# EAGLE design ext_esp_wroom_32-3 (EAGLE 9.6.2)
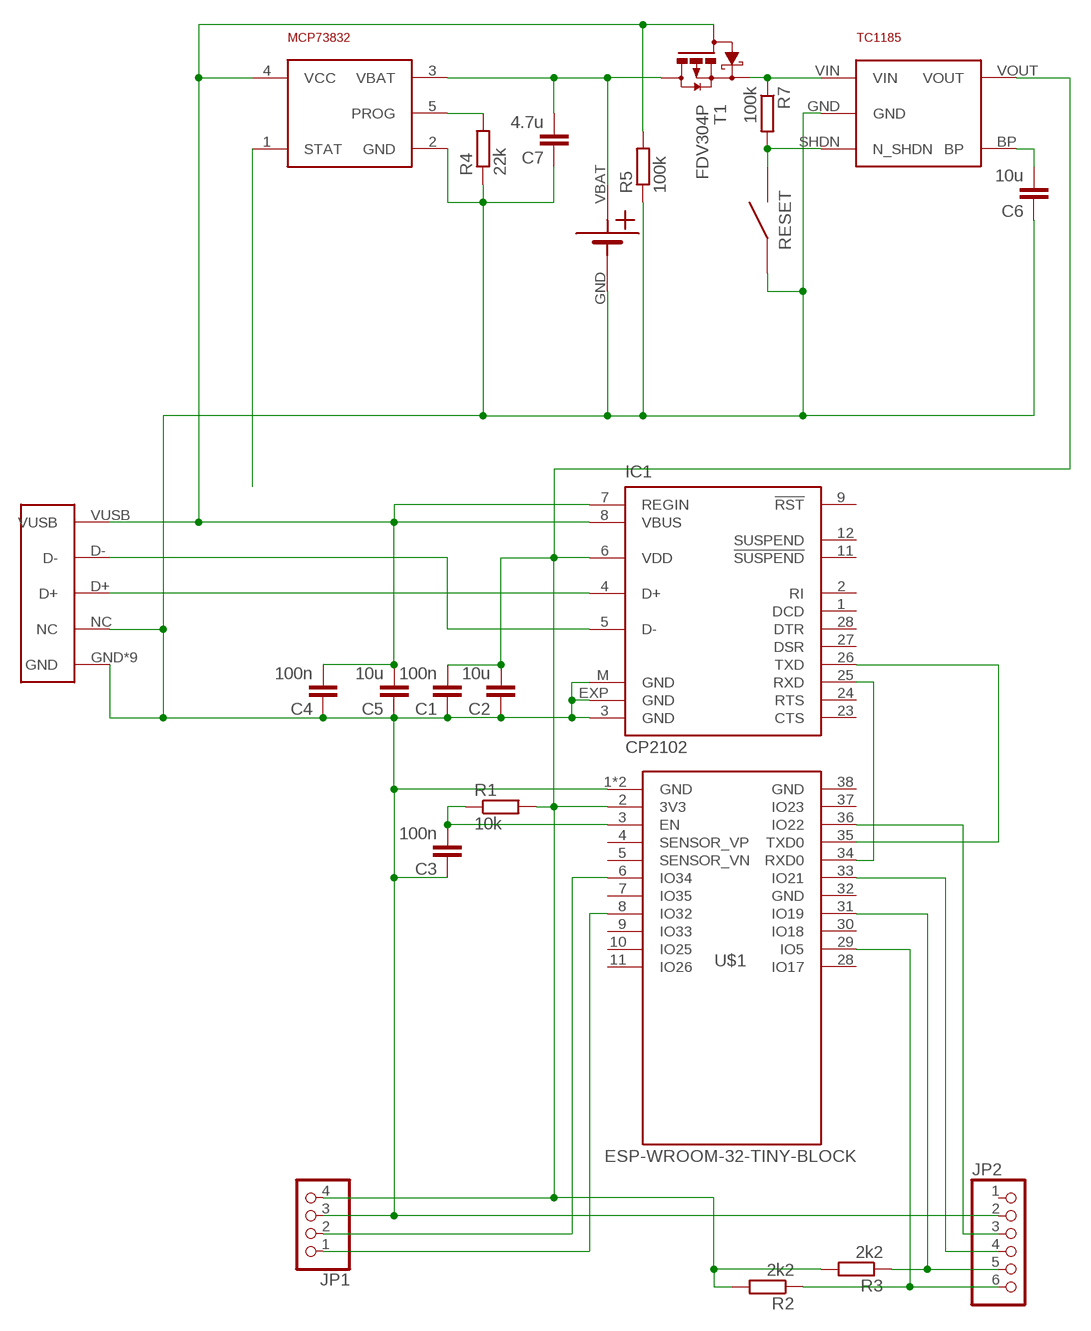
[diagram p0: schematic, sheet 1]

## Parts
C1  100n  C-EUC0805K  [C0805K]
C2  10u  C-EUC0805K  [C0805K]
C3  100n  C-EUC0805K  [C0805K]
C4  100n  C-EUC0805K  [C0805K]
C5  10u  C-EUC0805K  [C0805K]
C6  10u  C-EUC0805K  [C0805K]
C7  4.7u  C-EUC0603K  [C0603K]
IC1  CP2102  [MLP28]
JP1  PINHD-1X4  [1X04]
JP2  PINHD-1X6  [1X06]
MCP73832  MCP73831  [SOT23-5]
R1  10k  R-EU_R0805  [R0805]
R2  2k2  R-EU_R0805  [R0805]
R3  2k2  R-EU_R0805  [R0805]
R4  22k  R-EU_R0603  [R0603]
R5  100k  R-EU_R0603  [R0603]
R7  100k  R-EU_R0603  [R0603]
RESET  BYTTON-B3U  [BUTTON-B3U]
T1  FDV304P  P-MOSFET-FDV304P  [SOT23]
TC1185  TC1185  STABILISER_APE8865  [SOT32-5]
U$1  ESP-WROOM-32-TINY-BLOCK  [ESP-WROOM-32-TINY-BLOCK]
U$3  LIPOL_21X17  [LIPOL_21X17]
USB  USBMICRO  [MICROUSB-MOLEX]

## Nets
EN: C3.2 R1.1 U$1.3(EN)
GND: C1.1 C2.1 C3.1 C4.1 C5.1 C6.1 C7.1 IC1.3(GND) IC1.EXP(GND) IC1.M(GND) JP1.3 JP2.2 MCP73832.2(GND) R4.1 R5.1 RESET.P$1 TC1185.GND U$1.1(GND) U$1.GND U$3.GND USB.GND USB.GND1(GND) USB.GND2(GND) USB.GND3(GND) USB.GND4(GND) USB.NC USB.P$1(GND) USB.P$2(GND) USB.P$3(GND) USB.P$6(GND)
N$1: IC1.5(D-) USB.D-
N$2: IC1.4(D+) USB.D+
N$3: C6.2 TC1185.BP
N$4: IC1.26(TXD) U$1.35(TXD0)
N$6: IC1.25(RXD) U$1.34(RXD0)
N$7: R7.1 T1.S TC1185.VIN
N$8: C7.2 MCP73832.3(VBAT) T1.D U$3.VBAT
N$9: C4.2 C5.2 IC1.7(REGIN) IC1.8(VBUS) MCP73832.4(VCC) R5.2 T1.G USB.VUSB
N$11: MCP73832.5(PROG) R4.2
N$13: MCP73832.1(STAT)
N$20: R7.2 RESET.P$2 TC1185.SHDN(N_SHDN)
P0: JP1.2 U$1.6(IO34)
P1: JP1.1 U$1.8(IO32)
P4: JP2.3 U$1.36(IO22)
SCL: JP2.5 R3.1 U$1.31(IO19)
SDA: JP2.6 R2.1 U$1.29(IO5)
UPDI: JP2.4 U$1.33(IO21)
VCC: C1.2 C2.2 IC1.6(VDD) JP1.4 R1.2 R2.2 R3.2 TC1185.VOUT U$1.2(3V3)
Unconnected: IC1.1(DCD) IC1.2(RI) IC1.9(!RST) IC1.11(!SUSPEND) IC1.12(SUSPEND) IC1.23(CTS) IC1.24(RTS) IC1.27(DSR) IC1.28(DTR) JP2.1 U$1.4(SENSOR_VP) U$1.5(SENSOR_VN) U$1.7(IO35) U$1.9(IO33) U$1.10(IO25) U$1.11(IO26) U$1.28(IO17) U$1.30(IO18) U$1.37(IO23)

## Power pins joined to a net without a drawn wire
GND: U$1.32(GND) U$1.38(GND)

## Library data of the parts
C1-C6 = rcl:C-EU: CAPACITOR, European symbol; SPICEPREFIX: C
C7 = resistor:C-EU: CAPACITOR, European symbol
IC1 = silabs:CP210*: Single-Chip USB to UART Bridge Source: www.silabs.com .. CP2101.pdf / cp2102.pdf; MF: FARNELL; MPN: CP2102-GM; OC_FARNELL: 9282130; OC_NEWARK: 30K5635
JP1 = pinhead2:PINHD-1X4: PIN HEADER
JP2 = pinhead2:PINHD-1X6: PIN HEADER
MCP73832 = !stavebnice03:MCP73831
R1-R3 = rcl:R-EU_: RESISTOR, European symbol; SPICEPREFIX: R
R4 R5 R7 = resistor:R-EU_: RESISTOR, European symbol
RESET = !stavebnice03:BYTTON-B3U
T1 = !stavebnice03:P-MOSFET-FDV304P
TC1185 = !stavebnice03:STABILISER_APE8865
U$1 = esp32:ESP-WROOM-32-TINY-BLOCK
U$3 = !stavebnice03:LIPOL_21X17
USB = !stavebnice03:USBMICRO

## Board
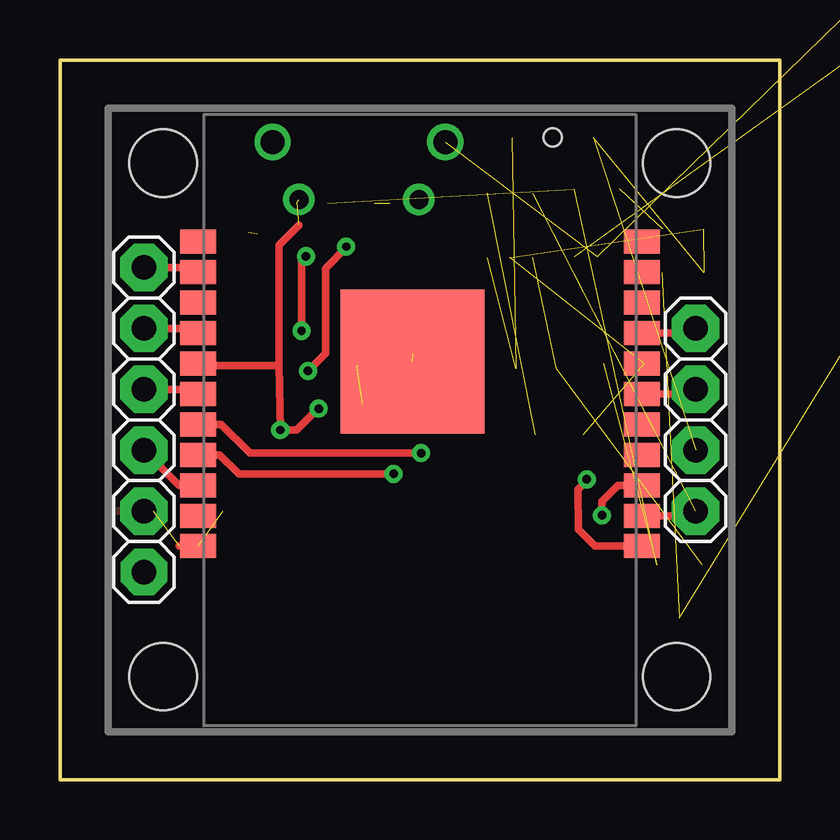
[diagram p1: board, top side]
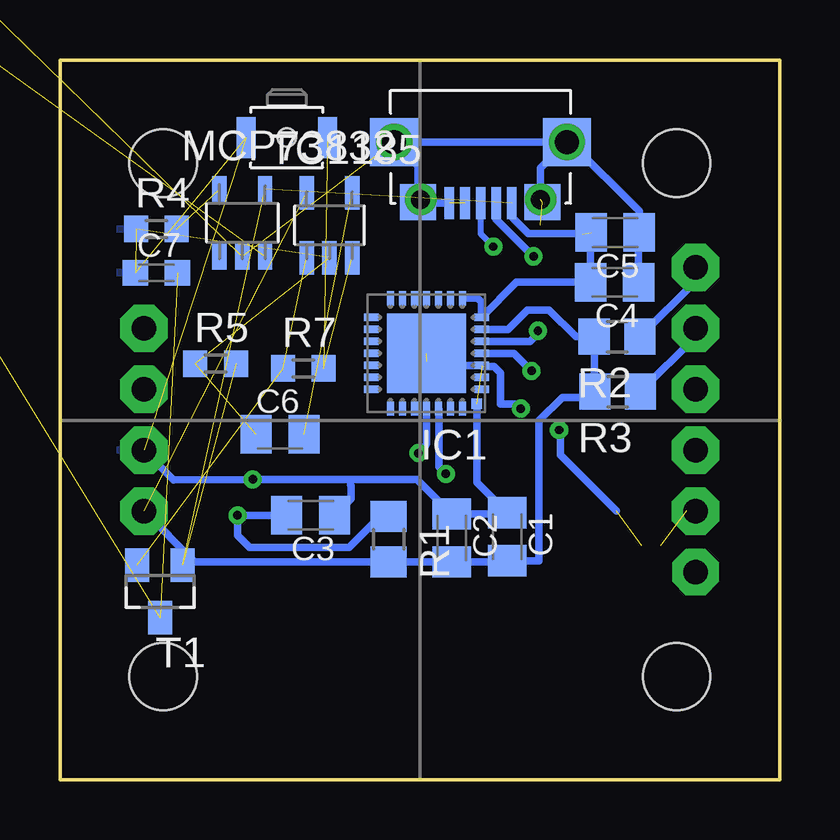
[diagram p2: board, bottom side, seen from below]

Size 30 x 30 mm. Coordinates in mm from the lower left corner, seen from the top.
Outline: 0,0 0,30 30,30 30,0 0,0
Copper layers (1*16): Top 0.035mm / dielectric 1.5mm / Bottom 0.035mm
Design rules "default *": minimum track width 10mil, minimum drill 0.35mm, track to track 6mil, track to pad 6mil, pad to pad 6mil, via to via 6mil, smd to smd 6mil, copper to edge 15mil, drill to drill 15mil, minimum pad ring 10mil, minimum via ring 8mil, stop-mask expansion 4mil, vias tented up to drill 0mil, thermal gap 10mil
Holes 2.8 mm at 4.3,4.3 25.7,25.7 25.7,4.3 4.3,25.7

### Footprints (pad centres in the part's own frame; a part is rotated, then mirrored left to right if it is on the bottom)
C0805K = smd 1.3 x 1.6: 1 -1,0; 2 1,0
C0603K = smd 1.05 x 1.08: 1 -0.875,0; 2 0.875,0
MLP28 = smd 0.6 x 0.3: 1 -2.3,1.5; 2 -2.3,1; 3 -2.3,0.5; 4 -2.3,0; 5 -2.3,-0.5; 6 -2.3,-1; 7 -2.3,-1.5; 15 2.3,-1.5; 16 2.3,-1; 17 2.3,-0.5; 18 2.3,0; 19 2.3,0.5; 20 2.3,1; 21 2.3,1.5 | smd 0.3 x 0.6: 8 -1.5,-2.3; 9 -1,-2.3; 10 -0.5,-2.3; 11 0,-2.3; 12 0.5,-2.3; 13 1,-2.3; 14 1.5,-2.3; 22 1.5,2.3; 23 1,2.3; 24 0.5,2.3; 25 0,2.3; 26 -0.5,2.3; 27 -1,2.3; 28 -1.5,2.3 | smd 3.3 x 3.3: EXP 0,0 | smd 0.435 x 0.435: M -2.103,2.103
1X04 = drill 1.016 pad 1.981 octagon: 1 -3.81,0; 2 -1.27,0; 3 1.27,0; 4 3.81,0
1X06 = drill 1.016 pad 1.93 octagon: 1 -6.35,0 | drill 1.016 pad 1.981 octagon: 2 -3.81,0; 3 -1.27,0; 4 1.27,0; 5 3.81,0; 6 6.35,0
SOT23-5 = smd 0.6 x 1.1: 1 -0.95,-1.45; 2 0,-1.45; 3 0.95,-1.45; 4 0.95,1.35; 5 -0.95,1.35
R0805 = smd 1.3 x 1.5: 1 -0.95,0; 2 0.95,0
R0603 = smd 1 x 1.1: 1 -0.85,0; 2 0.85,0
BUTTON-B3U = smd 0.8 x 1.7: P$1 -1.7,0; P$2 1.7,0 | hole 0.75: 0,0
SOT23 = smd 1 x 1.4: D 0,1.1; G -0.95,-1.1; S 0.95,-1.1
SOT32-5 = smd 0.6 x 1.4: BP 0.95,1.35; GND 0,-1.35; SHDN 0.95,-1.35; VIN -0.95,-1.35; VOUT -0.95,1.35
ESP-WROOM-32-TINY-BLOCK = smd 1.5 x 1: 1 -9.25,8.27; 2 -9.25,7; 3 -9.25,5.73; 4 -9.25,4.46; 5 -9.25,3.19; 6 -9.25,1.92; 7 -9.25,0.65; 8 -9.25,-0.62; 9 -9.25,-1.89; 10 -9.25,-3.16; 11 -9.25,-4.43; 28 9.25,-4.43; 29 9.25,-3.16; 30 9.25,-1.89; 31 9.25,-0.62; 32 9.25,0.65; 33 9.25,1.92; 34 9.25,3.19; 35 9.25,4.46; 36 9.25,5.73; 37 9.25,7; 38 9.25,8.27 | smd 6 x 6: GND 0.3,0.57
LIPOL_21X17 = drill 0.7 pad 1.9 octagon: GND 6.3,9.7; VBAT 2.5,8.1
MICROUSB-MOLEX = smd 0.4 x 1.35: D+ 0,2.35; D- -0.65,2.35; GND 1.3,2.35; NC 0.65,2.35; VUSB -1.3,2.35 | smd 2 x 2: GND1 -3.6,-0.2; GND2 3.6,-0.2 | smd 1.5 x 1.5: GND3 -2.59,2.3; GND4 2.6,2.3 | drill 1: P$1 -3.6,-0.2; P$2 3.6,-0.2 | drill 0.8: P$3 -2.5,2.2; P$6 2.5,2.2

### Placement (x,y rotation side)
C1  11.35,10.12 270 bottom
C2  13.67,10.07 270 bottom
C3  19.55,11.02 180 bottom
C4  6.88,20.73 180 bottom
C5  6.85,22.8 180 bottom
C6  20.82,14.4 0 bottom
C7  25.98,21.13 0 bottom
IC1  14.72,17.77 180 bottom
JP1  26.5,15 270 top
JP2  3.5,15 90 top
MCP73832  22.4,23.26 0 bottom
R1  16.3,10.02 270 bottom
R2  6.78,18.46 180 bottom
R3  6.75,16.17 180 bottom
R4  25.98,22.95 0 bottom
R5  23.51,17.34 0 bottom
R7  19.86,17.14 0 bottom
RESET  20.54,26.77 0 bottom
T1  25.83,7.84 180 bottom
TC1185  18.76,23.11 0 bottom
U$1  15,18 180 top
U$3  48.3,31.21 0 bottom  (outside the outline)
USB  12.47,26.38 180 bottom

### Tracks (layer width: path | path; a pad name or v marks a point on that pad's centre or on a via)
EN  (via drill 0.35)
  Top 0.305: U$1.3 23.27,12.27 22.6,11.6 v22.6,11.02
  Bottom 0.305: R1.1 16.66,10.97 17.95,9.68 22.09,9.68 22.6,10.18 v22.6,11.02 C3.2
GND  (via drill 0.35)  (16 unrouted)
  Top 0.305: 4.96,9.73 U$1.38 | v10.79,15.46 10.76,15.46 9.87,14.57 v9.19,14.57 9.14,17.27 | 9.14,17.27 9.14,22.29 9.96,23.11 | 9.14,17.27 5.83,17.27 U$1.32 | U$1.1 22.31,9.73 21.62,10.42 21.6,12.1 21.86,12.36 21.86,12.41 v21.96,12.52
  Bottom 0.305: v9.19,14.57 9.14,14.57 9.14,13.53 6.8,11.19 | v10.79,15.46 10.99,15.67 11.63,15.67 11.63,16.95 11.91,17.22 12.38,17.22 | 3.88,11.19 JP2.2 | USB.GND1 USB.P$2 15.06,25.58 USB.GND4 15.02,24.03 USB.GND 14.81,24.03 USB.P$6 14.96,23.44 | IC1.M 12.62,12.39 C1.1 11.4,11.07 C2.1 15.11,12.52 17.88,12.52 | C4.1 5.88,22.78 C5.1 5.85,23.69 8.74,26.58 USB.GND1 | USB.GND1 9.96,25.48 USB.P$3 | C3.1 17.86,11.7 17.86,12.26 17.88,12.28 17.88,12.52 | 21.91,12.46 v21.96,12.52 | v21.96,12.52 25.27,12.5 JP1.3 | IC1.EXP 14.22,17.27 IC1.3 | v21.96,12.52 17.88,12.52
  pour Top: 2.5,27.5 2.66,27.5 2.66,2.5 2.5,2.5
  pour Bottom: 27.19,27.5 27.5,27.5 27.5,2.5 27.19,2.5
N$1  (via drill 0.35)
  Top 0.305: v10.26,21.81 10.08,21.63 v10.08,18.71 v10.07,18.7
  Bottom 0.305: v10.07,18.7 10.07,18.6 10.41,18.27 IC1.5 | USB.D- 11.81,23.37 v10.26,21.81
N$2  (via drill 0.35)
  Top 0.305: v11.93,22.22 11.93,22.17 11.07,21.3 11.07,17.76 v10.34,17.03
  Bottom 0.254: USB.D+ 12.46,22.75 v11.93,22.22
  Bottom 0.305: USB.D+ 12.43,24 | v10.34,17.03 11.08,17.77 IC1.4
N$3  (1 unrouted)
N$4  (via drill 0.35)
  Top 0.305: U$1.35 6.67,13.54 7.46,12.74 v13.91,12.74
  Bottom 0.305: IC1.26 14.2,15.44 14.2,13.03 v13.91,12.74
N$6  (via drill 0.35)
  Top 0.305: v15.06,13.61 7.92,13.61 6.72,14.81 U$1.34
  Bottom 0.305: IC1.25 14.72,13.99 14.78,13.88 v15.06,13.61
N$7  (2 unrouted)
N$8  (3 unrouted)
N$9  (4 unrouted)
  Bottom 0.305: IC1.8 12.59,20.07 12.42,19.9 IC1.7 10.96,20.73 C4.2 7.88,22.4 8.22,22.74 | IC1.8 12.79,20.07 | C5.2 7.98,22.8 8.03,22.75 10.48,22.75 11.16,23.44 USB.VUSB | IC1.8 12.71,20.07
N$11  (1 unrouted)
N$20  (2 unrouted)
P0
  Top 0.305: U$1.6 26.31,16.08 JP1.2
P1
  Top 0.305: U$1.8 26.31,18.62 JP1.1
P4
  Top 0.305: JP2.3 4.96,12.27 U$1.36
SCL
  Top 0.305: JP2.5 5.56,18.81 U$1.31
  Bottom 0.305: R3.1 3.5,18.47 JP2.5
SDA
  Top 0.305: JP2.6 5.56,21.35 U$1.29
  Bottom 0.305: R2.1 3.5,20.78 JP2.6
UPDI
  Top 0.305: JP2.4 5.56,16.27 U$1.33
VCC  (1 unrouted)
  Top 0.305: U$1.2 26.31,11 JP1.4
  Bottom 0.305: JP1.4 24.38,9.07 R1.2 C2.2 11.4,9.07 C1.2 10.02,9.12 10.02,14.97 9.06,15.94 7.94,15.94 R3.2 7.72,16.2 R2.2 8.49,18.46 9.61,19.58 10.51,19.58 11.32,18.77 IC1.6

### Text on the board
bDocu: GND | GND | VCC | VCC